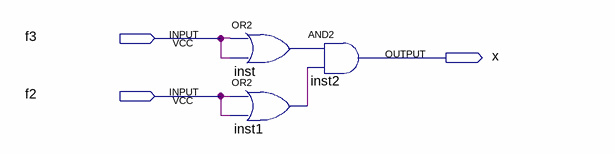
[diagram p0: schematic sheet]
// Quartus schematic rg_x.bdf as structural Verilog: 3 symbols, 3 pins
module rg_x (
  input  f3,
  input  f2,
  output x
);

  wire inst1_out, inst_out;

  or inst (inst_out, f3, f3);
  or inst1 (inst1_out, f2, f2);
  and inst2 (x, inst_out, inst1_out);
endmodule
